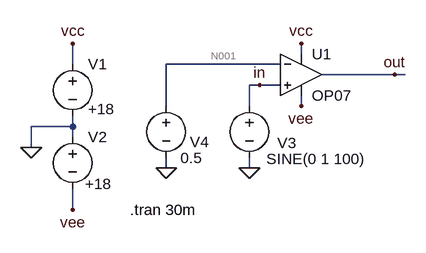
[diagram p0: schematic 17-comparator.asc]
17-comparator.asc, the LTspice schematic file:
Version 4
SHEET 1 880 680
WIRE 224 0 224 -16
WIRE -128 16 -128 -16
WIRE 192 16 16 16
WIRE 368 32 256 32
WIRE 384 32 368 32
WIRE 160 48 144 48
WIRE 192 48 160 48
WIRE 16 80 16 16
WIRE 144 80 144 48
WIRE 224 80 224 64
WIRE -128 112 -128 96
WIRE -128 112 -192 112
WIRE -128 128 -128 112
WIRE -192 144 -192 112
WIRE 16 176 16 160
WIRE 144 176 144 160
WIRE -128 240 -128 208
FLAG -192 144 0
FLAG -128 -16 vcc
FLAG -128 240 vee
FLAG 16 176 0
FLAG 160 48 in
FLAG 224 80 vee
FLAG 224 -16 vcc
FLAG 368 32 out
FLAG 144 176 0
SYMBOL OpAmps\\OP07 224 -32 R0
SYMATTR InstName U1
SYMBOL voltage -128 0 R0
WINDOW 3 24 85 Left 2
WINDOW 123 0 0 Left 0
WINDOW 39 0 0 Left 0
SYMATTR Value +18
SYMATTR InstName V1
SYMBOL voltage -128 112 R0
WINDOW 3 19 88 Left 2
WINDOW 123 0 0 Left 0
WINDOW 39 0 0 Left 0
SYMATTR Value +18
SYMATTR InstName V2
SYMBOL voltage 144 64 R0
WINDOW 0 43 73 Left 2
WINDOW 3 26 98 Left 2
WINDOW 123 0 0 Left 0
WINDOW 39 0 0 Left 0
SYMATTR InstName V3
SYMATTR Value SINE(0 1 100)
SYMBOL voltage 16 64 R0
WINDOW 0 37 72 Left 2
WINDOW 3 22 96 Left 2
WINDOW 123 0 0 Left 0
WINDOW 39 0 0 Left 0
SYMATTR InstName V4
SYMATTR Value 0.5
TEXT -40 240 Left 2 !.tran 30m

The netlist it stands for:
* 17-comparator.asc
XU1 in N001 vcc vee out LT1001  ; OP07, pins In+ In- V+ V- OUT
V1 vcc 0 +18
V2 0 vee +18
V3 in 0 SINE(0 1 100)
V4 N001 0 0.5
.tran 30m
.lib LTC.lib
.backanno
.end

* Results of the author's LTspice run, read from the files saved beside the schematic
* Operating Point, zero values left out:
*   V(n001) = 500 mV
*   V(vcc) = 18 V
*   V(vee) = -18 V
*   V(out) = -17.07 V
*   I(V4) = -6.751 nA
*   I(V3) = 6.75 nA
*   I(V2) = -2.247 mA
*   I(V1) = -2.254 mA
*   Ix(u1:1) = -6.75 nA
*   Ix(u1:2) = 6.751 nA
*   Ix(u1:3) = 2.254 mA
*   Ix(u1:4) = -2.247 mA
*   Ix(u1:5) = 34.14 pA
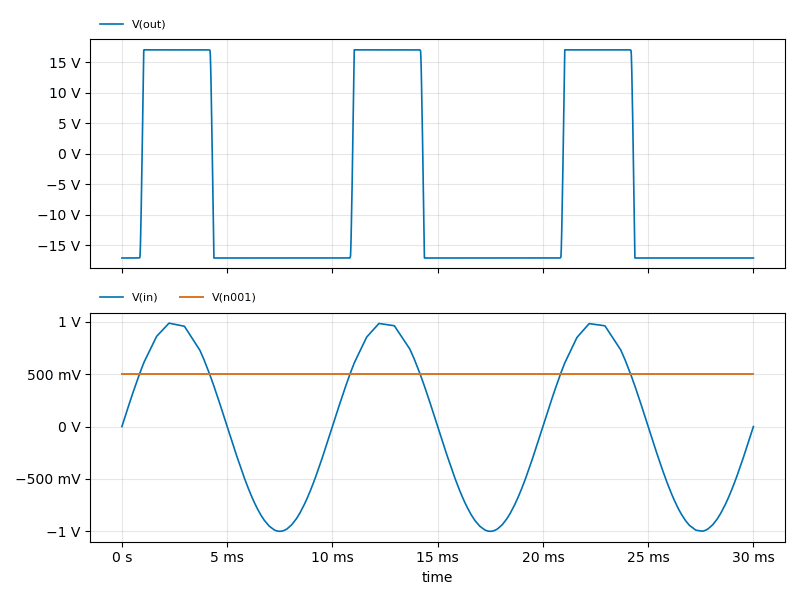
[diagram p1: Transient Analysis of 17-comparator.asc, plotted from the saved traces]
* Transient Analysis, 1 run:
*   V(out): min -17.07 V, max 17.07 V, average -5.694 V, rms 16.89 V, last -17.07 V
*   V(in): min -1 V, max 986.4 mV, average -3.298 mV, rms 704 mV, last 0 V
*   V(n001): min 500 mV, max 500 mV, average 500 mV, rms 500 mV, last 500 mV